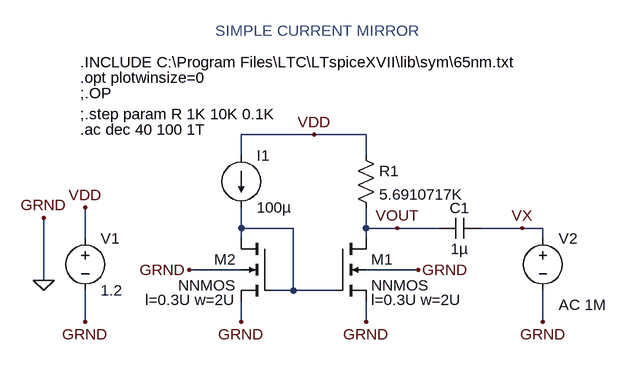
[diagram p0: schematic 13SIMPLE CURRENT MIRROR NMOS.asc]
13SIMPLE CURRENT MIRROR NMOS.asc, the LTspice schematic file:
Version 4
SHEET 1 880 680
WIRE 96 -32 -16 -32
WIRE 176 -32 96 -32
WIRE -16 0 -16 -32
WIRE 176 0 176 -32
WIRE -16 112 -16 80
WIRE 64 112 -16 112
WIRE 176 112 176 80
WIRE 224 112 176 112
WIRE 288 112 224 112
WIRE 416 112 352 112
WIRE 448 112 416 112
WIRE -256 128 -256 80
WIRE -16 128 -16 112
WIRE 176 128 176 112
WIRE 448 128 448 112
WIRE -16 176 -96 176
WIRE 256 176 176 176
WIRE -320 192 -320 96
WIRE 64 208 64 112
WIRE 64 208 32 208
WIRE 128 208 64 208
WIRE -256 256 -256 208
WIRE -16 256 -16 224
WIRE 176 256 176 224
WIRE 448 256 448 208
FLAG -320 192 0
FLAG -256 80 VDD
FLAG -320 96 GRND
FLAG -256 256 GRND
FLAG -16 256 GRND
FLAG 176 256 GRND
FLAG -96 176 GRND
FLAG 256 176 GRND
FLAG 448 256 GRND
FLAG 96 -32 VDD
FLAG 416 112 VX
FLAG 224 112 VOUT
SYMBOL nmos4 128 128 R0
WINDOW 123 56 94 Left 2
SYMATTR Value2 l=0.3U w=2U
SYMATTR InstName M1
SYMATTR Value NNMOS
SYMBOL nmos4 32 128 M0
WINDOW 123 56 94 Left 2
SYMATTR Value2 l=0.3U w=2U
SYMATTR InstName M2
SYMATTR Value NNMOS
SYMBOL voltage -256 112 R0
WINDOW 123 0 0 Left 0
WINDOW 39 0 0 Left 0
SYMATTR InstName V1
SYMATTR Value 1.2
SYMBOL current -16 0 R0
SYMATTR InstName I1
SYMATTR Value 100µ
SYMBOL res 160 -16 R0
SYMATTR InstName R1
SYMATTR Value 5.6910717K
SYMBOL cap 352 96 R90
WINDOW 0 0 32 VBottom 2
WINDOW 3 32 32 VTop 2
SYMATTR InstName C1
SYMATTR Value 1µ
SYMBOL voltage 448 112 R0
WINDOW 123 24 118 Left 2
WINDOW 39 0 0 Left 0
SYMATTR Value2 AC 1M
SYMATTR InstName V2
SYMATTR Value ""
TEXT -264 -144 Left 2 !.INCLUDE C:\\Program Files\\LTC\\LTspiceXVII\\lib\\sym\\65nm.txt
TEXT -264 -120 Left 2 !.opt plotwinsize=0
TEXT -264 -96 Left 2 !;.OP
TEXT -264 -64 Left 2 !;.step param R 1K 10K 0.1K
TEXT -264 -40 Left 2 !.ac dec 40 100 1T
TEXT -56 -192 Left 2 ;SIMPLE CURRENT MIRROR

The netlist it stands for:
* 13SIMPLE CURRENT MIRROR NMOS.asc
M1 VOUT N001 0 0 NNMOS l=0.3U w=2U
M2 N001 N001 0 0 NNMOS l=0.3U w=2U
V1 VDD 0 1.2
I1 VDD N001 100µ
R1 VDD VOUT 5.6910717K
C1 VX VOUT 1µ
V2 VX 0 AC 1M
.model NMOS NMOS
.model PMOS PMOS
.lib standard.mos
.INCLUDE C:\Program Files\LTC\LTspiceXVII\lib\sym\65nm.txt
.opt plotwinsize=0
;.OP
;.step param R 1K 10K 0.1K
.ac dec 40 100 1T
* SIMPLE CURRENT MIRROR
.backanno
.end